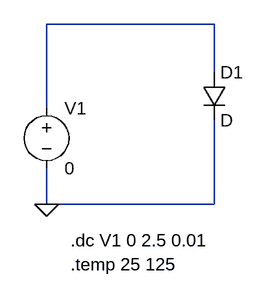
[diagram p0: schematic diode.asc]
diode.asc, the LTspice schematic file:
Version 4
SHEET 1 880 680
WIRE 336 16 112 16
WIRE 336 80 336 16
WIRE 112 128 112 16
WIRE 112 256 112 208
WIRE 336 256 336 144
WIRE 336 256 112 256
FLAG 112 256 0
SYMBOL voltage 112 112 R0
WINDOW 123 0 0 Left 0
WINDOW 39 0 0 Left 0
SYMATTR InstName V1
SYMATTR Value 0
SYMBOL diode 320 80 R0
SYMATTR InstName D1
TEXT 144 304 Left 2 !.dc V1 0 2.5 0.01
TEXT 144 336 Left 2 !.temp 25 125

The netlist it stands for:
* diode.asc
V1 N001 0 0
D1 N001 0 D
.model D D
.lib standard.dio
.dc V1 0 2.5 0.01
.temp 25 125
.backanno
.end